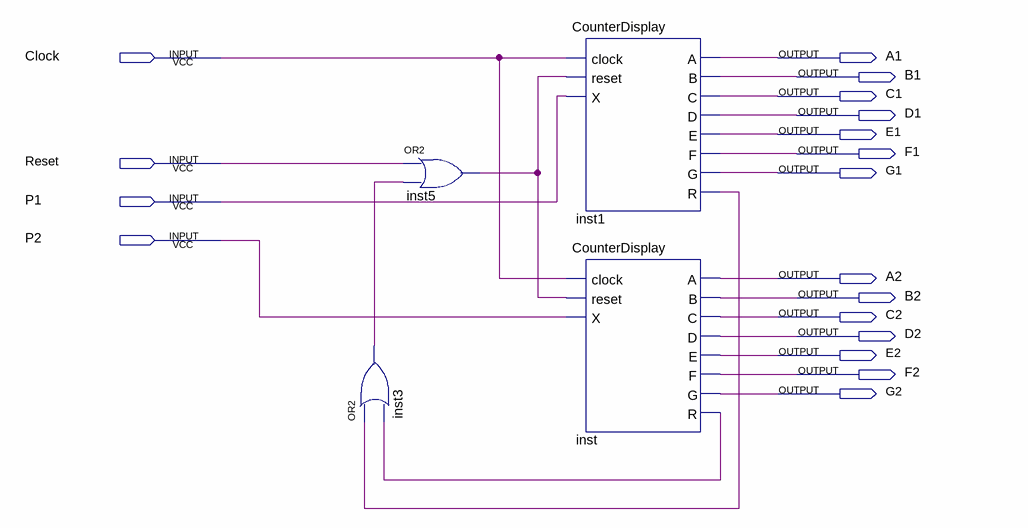
[diagram p0: schematic sheet]
// Quartus schematic FinalScoreBoard.bdf as structural Verilog: 4 symbols, 18 pins
module FinalScoreBoard (
  input  Clock,
  input  Reset,
  input  P1,
  input  P2,
  output A1,
  output B1,
  output C1,
  output D1,
  output E1,
  output F1,
  output G1,
  output A2,
  output B2,
  output C2,
  output D2,
  output E2,
  output F2,
  output G2
);

  wire inst1_r, inst3_out, inst5_out, inst_r;

  or inst5 (inst5_out, Reset, inst3_out);
  or inst3 (inst3_out, inst1_r, inst_r);
  CounterDisplay inst1 (
    .clock(Clock), .reset(inst5_out), .X(P1), .A(A1), .B(B1), .C(C1), .D(D1), .E(E1), .F(F1), .G(G1),
    .R(inst1_r));
  CounterDisplay inst (
    .clock(Clock), .reset(inst5_out), .X(P2), .A(A2), .B(B2), .C(C2), .D(D2), .E(E2), .F(F2), .G(G2),
    .R(inst_r));
endmodule
